# EAGLE design template-2layer (EAGLE 6.1)
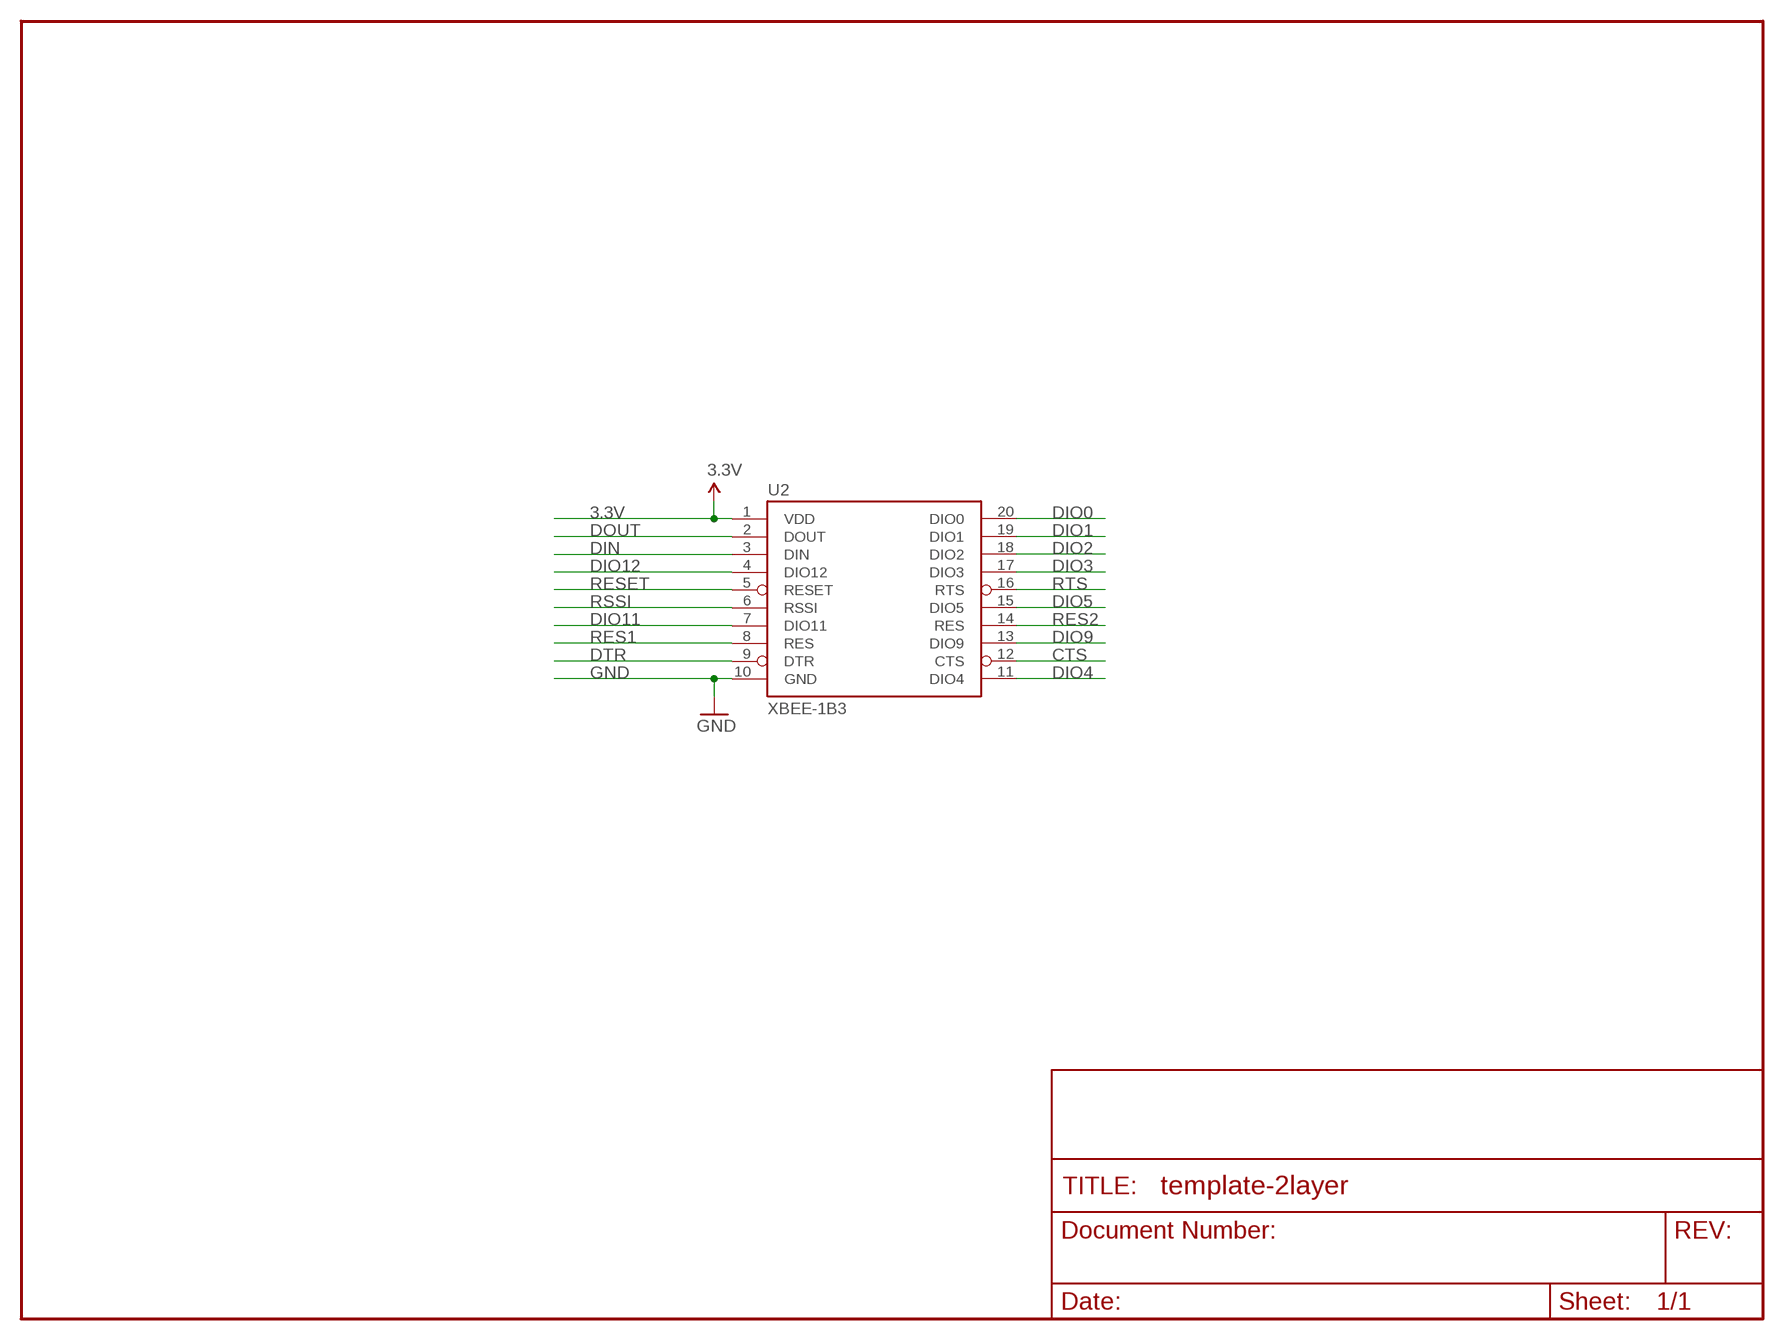
[diagram p0: schematic, sheet 1]

## Parts
U2  XBEE-1B3  [XBEE-SMD]

## Nets
3.3V [vcc]: U2.1(VDD)
CTS: U2.12(CTS)
DIO0: U2.20(DIO0)
DIO1: U2.19(DIO1)
DIO2: U2.18(DIO2)
DIO3: U2.17(DIO3)
DIO4: U2.11(DIO4)
DIO5: U2.15(DIO5)
DIO9: U2.13(DIO9)
DIO11: U2.7(DIO11)
DIO12: U2.4(DIO12)
DOUT: U2.2(DOUT)
DTR: U2.9(DTR)
GND [vcc]: U2.10(GND)
RES1: U2.8(RES)
RES2: U2.14(RES)
RESET: U2.5(RESET)
RSSI: U2.6(RSSI)
RTS: U2.16(RTS)
Unconnected: U2.3(DIN)

## Library data of the parts
U2 = SparkFun:XBEE-1

## Net classes
0 default: width 0.203 mm
1 vcc: width 0.305 mm
2 gnd: width 0.254 mm

## Board
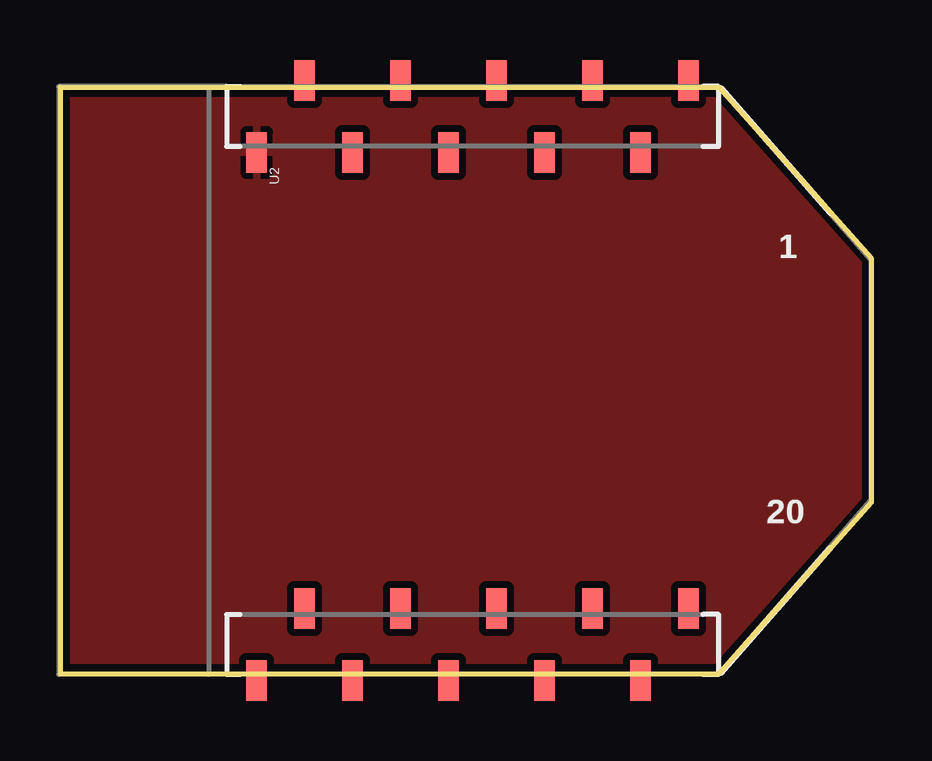
[diagram p1: board, top side]
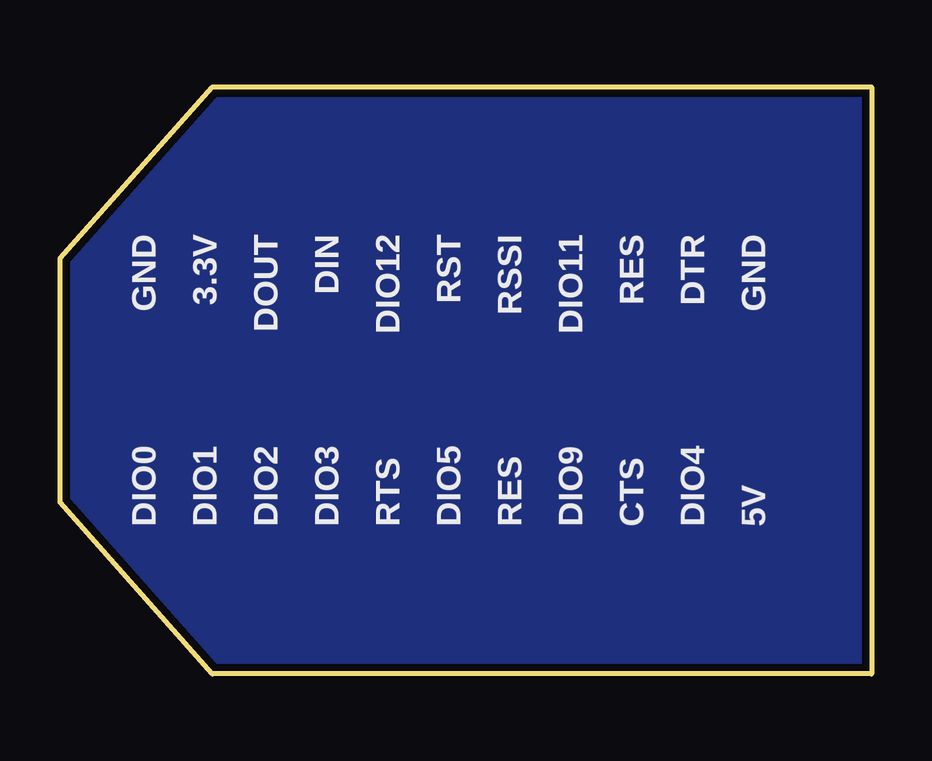
[diagram p2: board, bottom side, seen from below]

Size 33.81 x 24.45 mm. Coordinates in mm from the lower left corner, seen from the top.
Outline: 27.46,0 33.81,7.14 33.81,17.3 27.46,24.45 0,24.45 0,0 27.46,0
Copper layers (1*16): Top 0.035mm / dielectric 1.5mm / Bottom 0.035mm
Design rules: minimum track width 8mil, minimum drill 20mil, track to track 8mil, track to pad 8mil, pad to pad 8mil, via to via 8mil, smd to smd 8mil, copper to edge 10mil, drill to drill 8mil, minimum pad ring 12mil, minimum via ring 10mil, stop-mask expansion 4mil, vias tented up to drill 20mil, thermal gap 10mil

### Footprints (pad centres in the part's own frame; a part is rotated, then mirrored left to right if it is on the bottom)
XBEE-SMD = smd 1.7 x 0.85: 1 -12.5,20; 2 -9.5,18; 3 -12.5,16; 4 -9.5,14; 5 -12.5,12; 6 -9.5,10; 7 -12.5,8; 8 -9.5,6; 9 -12.5,4; 10 -9.5,2; 11 12.5,2; 12 9.5,4; 13 12.5,6; 14 9.5,8; 15 12.5,10; 16 9.5,12; 17 12.5,14; 18 9.5,16; 19 12.5,18; 20 9.5,20

### Placement (x,y rotation side)
U2  6.19,12.22 270 top

### Tracks (layer width: path | path; a pad name or v marks a point on that pad's centre or on a via)
GND
  pour Bottom (isolate 0.305): 0,24.45 27.46,24.45 33.5,17.62 33.81,17.3 33.81,7.14 27.46,0 0,0
  pour Top (isolate 0.305): 0,24.45 27.46,24.45 28.1,23.81 33.81,17.3 33.81,7.14 27.46,0 0,0

### Text on the board
tPlace: 1 | 20
bPlace: GND | DTR | RES | DIO11 | RSSI | RST | DIO12 | DIN | DOUT | 3.3V | GND | 5V | DIO4 | CTS | DIO9 | RES | DIO5 | RTS | DIO3 | DIO2 | DIO1 | DIO0
tValues: XBee Socket Up | DNP | DNP | XBee Socket Up